# Altium schematic sheet leg.SchDoc
size A4; Organization: Altium Limited; Address1: L3, 12a Rodborough Rd; Address2: Frenchs Forest; Address3: NSW; Address4: Australia 2086
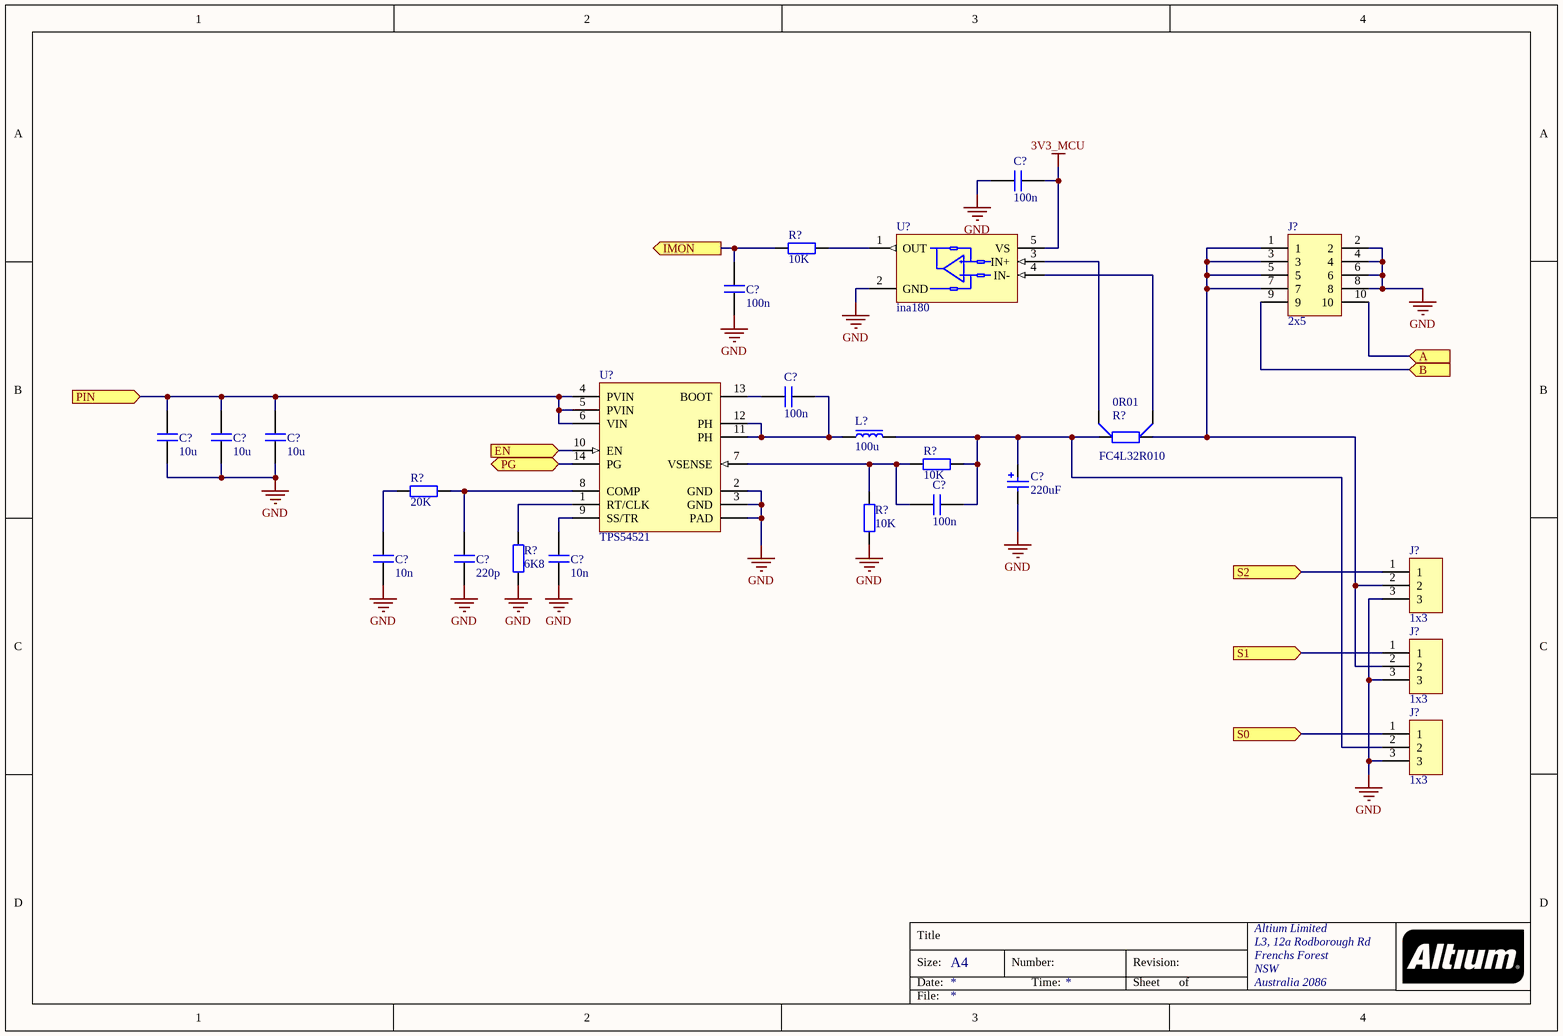
[diagram p0: leg.SchDoc]

## Parts
(Parts that share a designator on the sheet are numbered #1, #2 ... from top to bottom, then left to right.)
C?#1  value 100n  [CAPC1005X06N]  (hidden comment: cap)
C?#2  value 100n  [CAPC1005X06N]  (hidden comment: cap)
C?#3  value 100n  [CAPC1608X08N]  (hidden comment: cap)
C?#4  value 10u  [CAPC3216X14N]  (hidden comment: cap)
C?#5  value 10u  [CAPC3216X14N]  (hidden comment: cap)
C?#6  value 10u  [CAPC3216X14N]  (hidden comment: cap)
C?#7  value 100n  [CAPC1005X06N]  (hidden comment: cap)
C?#8  value 220uF  [WCAP-PSLP_6.3x5.8]  (hidden comment: 875105244013)
C?#9  value 10n  [CAPC4564X11N]  (hidden comment: cap)
C?#10  value 220p  [CAPC4564X11N]  (hidden comment: cap)
C?#11  value 10n  [CAPC4564X11N]  (hidden comment: cap)
J?#1  2x5  [hdr_2x5_50mil]
J?#2  1x3  [hdr_1x3_100mil]
J?#3  1x3  [hdr_1x3_100mil]
J?#4  1x3  [hdr_1x3_100mil]
L?  value 100u  [INDP120120X60N]  (hidden comment: inds)
R?#1  value 10K  [RESC1005X04N]  (hidden comment: res)
R?#2  FC4L32R010  value 0R01  [4T_RESC1632X05N]
R?#3  value 10K  [RESC1005X04N]  (hidden comment: res)
R?#4  value 20K  [RESC1005X04N]  (hidden comment: res)
R?#5  value 10K  [RESC1005X04N]  (hidden comment: res)
R?#6  value 6K8  [RESC1005X04N]  (hidden comment: res)
U?#1  ina180  [SOT95P280X145-5N]
U?#2  TPS54521  [QFN50P350X350X100_HS-19N]

## Ports
A (in), B (in), EN (in), IMON (out), PG (bidir), PIN (in), S0 (in), S1 (in), S2 (in)

## Nets
3V3_MCU: C?#1.2 U?#1.5(VS)
GND: C?#1.1 C?#2.1 C?#4.1 C?#5.1 C?#6.1 C?#8.2(N) C?#9.1 C?#10.1 C?#11.1 J?#1.2 J?#1.4 J?#1.6 J?#1.8 J?#2.3 J?#3.3 J?#4.3 R?#5.2 R?#6.1 U?#1.2(GND) U?#2.2(GND) U?#2.3(GND) U?#2.PAD
A: J?#1.10 ; port A
B: J?#1.9 ; port B
EN: U?#2.10(EN) ; port EN
IMON: C?#2.2 R?#1.1 ; port IMON
PG: U?#2.14(PG) ; port PG
PIN: C?#4.2 C?#5.2 C?#6.2 U?#2.4(PVIN) U?#2.5(PVIN) U?#2.6(VIN) ; port PIN
S0: J?#4.1 ; port S0
S1: J?#3.1 ; port S1
S2: J?#2.1 ; port S2
NetC?#3_1: C?#3.1 U?#2.13(BOOT)
NetC?#3_2: C?#3.2 L?.1 U?#2.11(PH) U?#2.12(PH)
NetC?#7_1: C?#7.1 R?#3.1 R?#5.1 U?#2.7(VSENSE)
NetC?#7_2: C?#7.2 C?#8.1(P) J?#4.2 L?.2 R?#2.1 R?#3.2
NetC?#9_2: C?#9.2 R?#4.2
NetC?#10_2: C?#10.2 R?#4.1 U?#2.8(COMP)
NetC?#11_2: C?#11.2 U?#2.9(SS/TR)
NetJ?#1_1: J?#1.1 J?#1.3 J?#1.5 J?#1.7 J?#2.2 J?#3.2 R?#2.2
NetR?#1_2: R?#1.2 U?#1.1(OUT)
NetR?#2_3: R?#2.3 U?#1.3(IN+)
NetR?#2_4: R?#2.4 U?#1.4(IN-)
NetR?#6_2: R?#6.2 U?#2.1(RT/CLK)

## Notes on the sheet
- Title
- Size:
- Date:
- A4
- Number:
- Time:
- Revision:
- Sheet
- of
- File:

## Library data of the parts
C?#1-C?#7 C?#9-C?#11 = cap: Capacitor
C?#8 = 875105244013: WCAP-PSLP Aluminum Polymer Capacitors, size Ф6.3x5.8mm, 10V DC, 220uF; Rated Voltage: 10V DC; ComponentLink1Description: Manufacturer; ComponentLink1URL: http://www.we-online.de; ComponentLink2Description: Datasheet; ComponentLink2URL: http://katalog.we-online.de/pbs/datasheet/875105244013.pdf; Part Number: 875105244013; Published Date: June 2017; Publisher: Wurth Elektronik; Size: Ф6.3x5.8mm; Life Cycle: 2000h; Operating Temperature: -55 °C up to +105 °C
J?#1 = hdr_2x5: 2x5 Header
J?#2-J?#4 = hdr_1x3: 1x3 Header
L? = inds: Inductor
R?#1 R?#3-R?#6 = res: Resistor
R?#2 = res_4t: Resistor
U?#1 = ina180: Low- and High-Side Voltage Output, Current-Sense Amplifiers; Datasheet: http://www.ti.com/lit/ds/symlink/ina180.pdf
U?#2 = tps54521: 4.5V to 17V Input, 5A Synchronous Step Down Converter; ComponentLink1Description: Datasheet; ComponentLink1URL: http://www.ti.com/lit/gpn/tps54521